# EAGLE design 1uT_u_v1_1 (EAGLE 9.2.2)
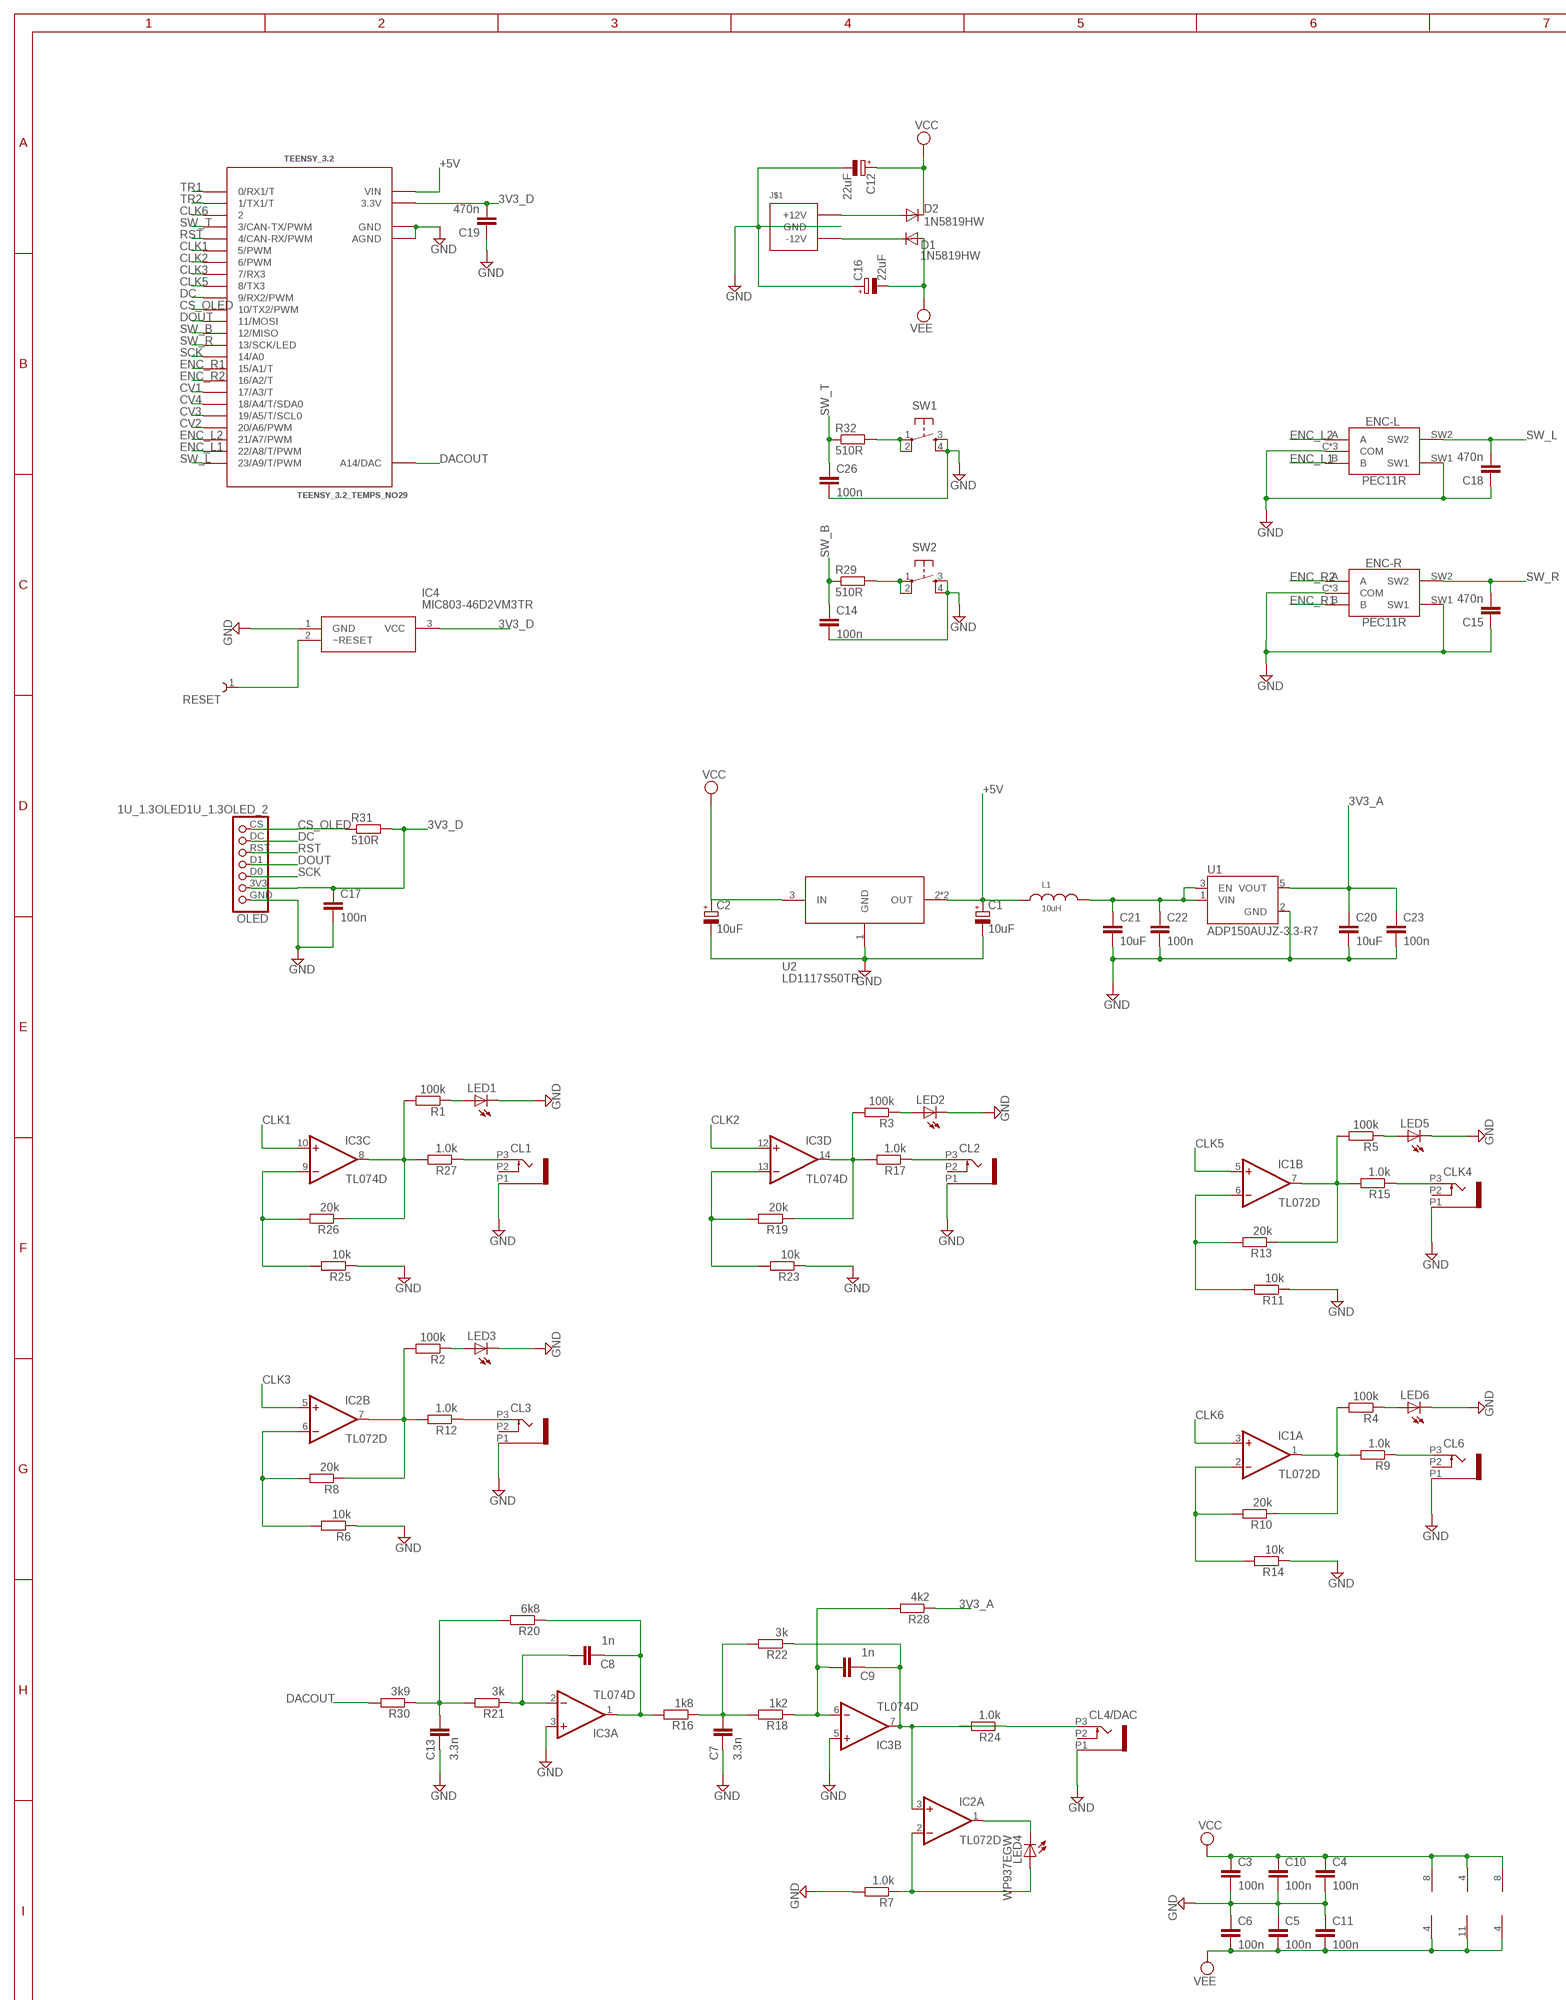
[diagram p0: schematic, sheet 1, part 1 of 2]
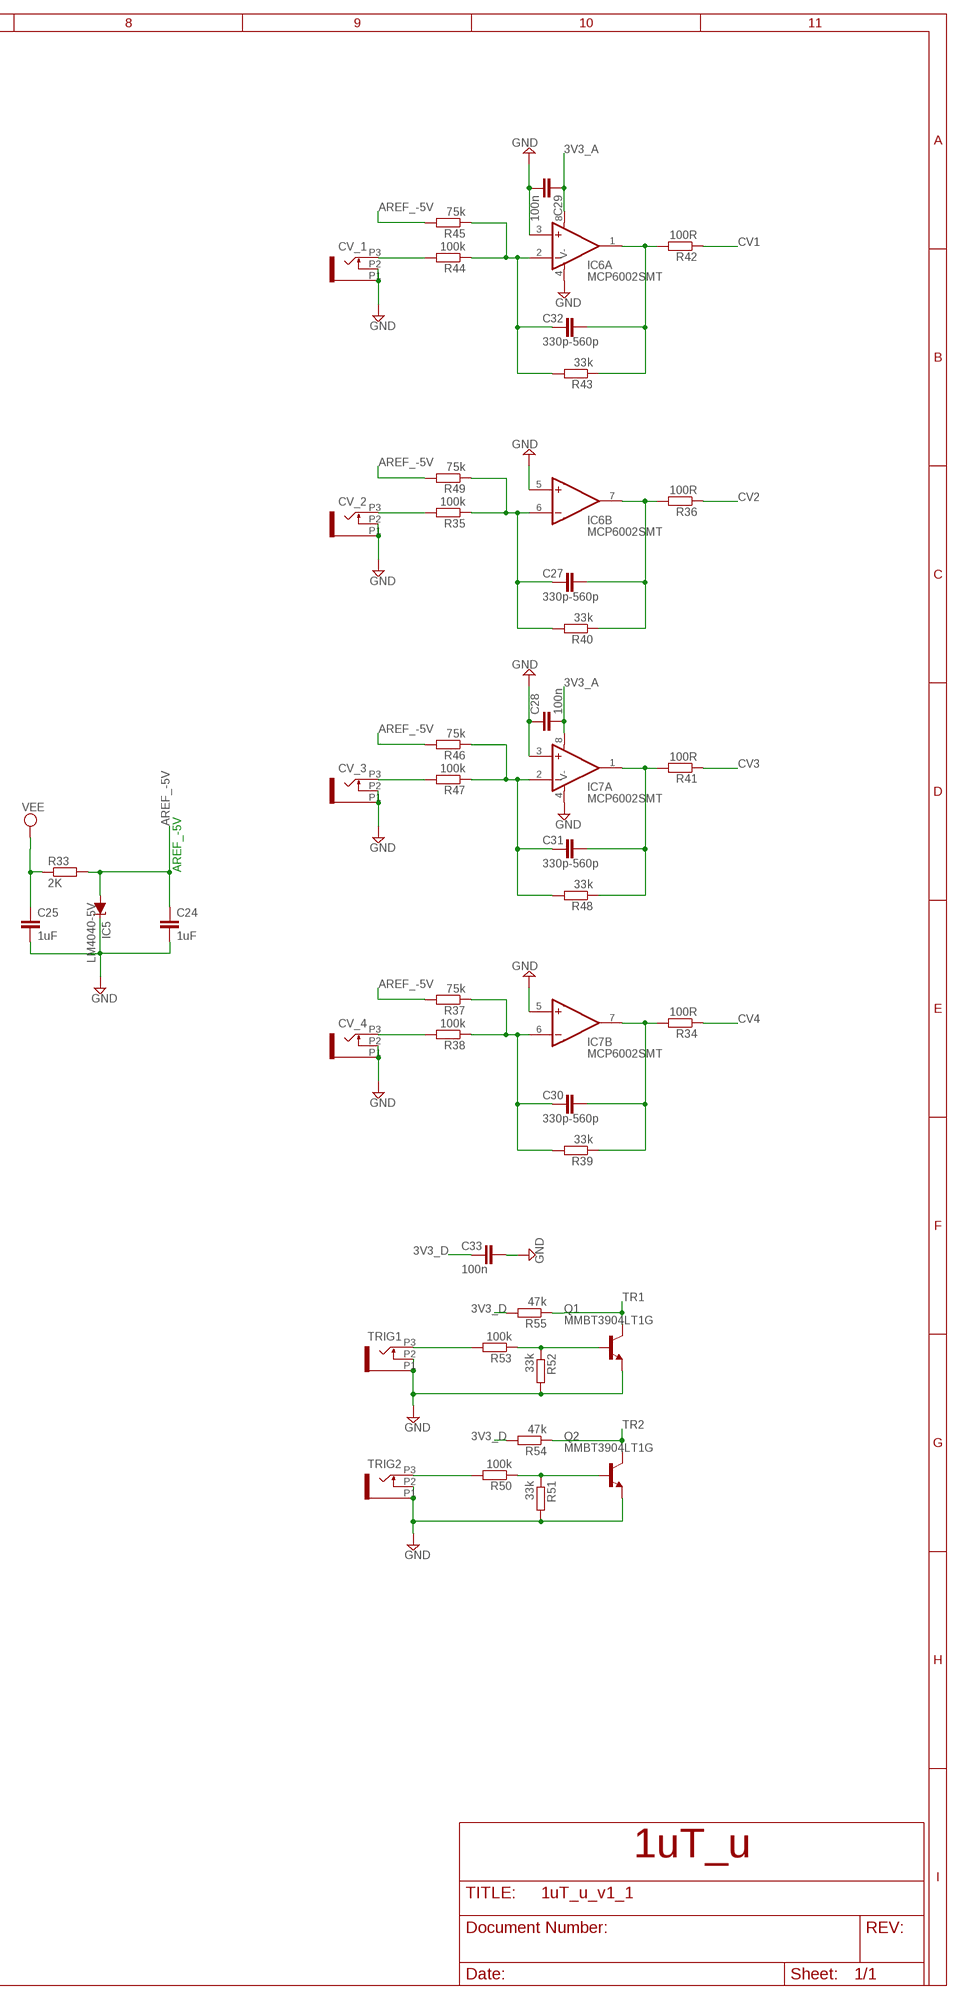
[diagram p1: schematic, sheet 1, part 2 of 2]

## Parts
C1  10uF  CPOL-EUB  [PANASONIC_B]
C2  10uF  CPOL-EUB  [PANASONIC_B]
C3  100n  C-EUC0603  [C0603]
C4  100n  C-EUC0603  [C0603]
C5  100n  C-EUC0603  [C0603]
C6  100n  C-EUC0603  [C0603]
C7  3.3n  C-EUC0603  [C0603]
C8  1n  C-EUC0603  [C0603]
C9  1n  C-EUC0603  [C0603]
C10  100n  C-EUC0603  [C0603]
C11  100n  C-EUC0603  [C0603]
C12  22uF  CPOL-EUC  [PANASONIC_C]
C13  3.3n  C-EUC0603  [C0603]
C14  100n  C-EUC0603  [C0603]
C15  470n  C-EUC0603  [C0603]
C16  22uF  CPOL-EUC  [PANASONIC_C]
C17  100n  C-EUC0603  [C0603]
C18  470n  C-EUC0603  [C0603]
C19  470n  C-EUC0603  [C0603]
C20  10uF  C-EUC1206K  [C1206K]
C21  10uF  C-EUC1206K  [C1206K]
C22  100n  C-EUC0603  [C0603]
C23  100n  C-EUC0603  [C0603]
C24  1uF  C-EUC0603  [C0603]
C25  1uF  C-EUC0603  [C0603]
C26  100n  C-EUC0603  [C0603]
C27  330p-560p  C-EUC0603  [C0603]
C28  100n  C-EUC0603  [C0603]
C29  100n  C-EUC0603  [C0603]
C30  330p-560p  C-EUC0603  [C0603]
C31  330p-560p  C-EUC0603  [C0603]
C32  330p-560p  C-EUC0603  [C0603]
C33  100n  C-EUC0603  [C0603]
CL1  OG-PJ301_PJ301_THONKICONN  [OG-PJ301_WQP_PJ_301M6_NO_HOLE]
CL2  OG-PJ301_PJ301_THONKICONN  [OG-PJ301_WQP_PJ_301M6_NO_HOLE]
CL3  OG-PJ301_PJ301_THONKICONN  [OG-PJ301_WQP_PJ_301M6_NO_HOLE]
CL4/DAC  OG-PJ301_PJ301_THONKICONN  [OG-PJ301_WQP_PJ_301M6_NO_HOLE]
CL6  OG-PJ301_PJ301_THONKICONN  [OG-PJ301_WQP_PJ_301M6_NO_HOLE]
CLK4  OG-PJ301_PJ301_THONKICONN  [OG-PJ301_WQP_PJ_301M6_NO_HOLE]
CV_1  OG-PJ301_PJ301_THONKICONN  [OG-PJ301_WQP_PJ_301M6_NO_HOLE]
CV_2  OG-PJ301_PJ301_THONKICONN  [OG-PJ301_WQP_PJ_301M6_NO_HOLE]
CV_3  OG-PJ301_PJ301_THONKICONN  [OG-PJ301_WQP_PJ_301M6_NO_HOLE]
CV_4  OG-PJ301_PJ301_THONKICONN  [OG-PJ301_WQP_PJ_301M6_NO_HOLE]
D1  1N5819HW  DIODE_DIODE-SOD123  [DIODE_SOD123]
D2  1N5819HW  DIODE_DIODE-SOD123  [DIODE_SOD123]
ENC-L  PEC11R  [PEC11R-4XXXK-SXXXX]
ENC-R  PEC11R  [PEC11R-4XXXK-SXXXX]
IC1  TL072D  [SO08]
IC2  TL072D  [SO08]
IC3  TL074D  [SO14]
IC4  MIC803-46D2VM3TR  [SOT95P230X110-3N]
IC5  LM4040-5V  LM4041B12DBZ  [DBZ_R-PDSO-G3]
IC6  MCP6002SMT  [SOIC8]
IC7  MCP6002SMT  [SOIC8]
J$1  POWER_SIMPLE10  [POWER_10]
L1  10uH  WE-LQ_1210_744032001  [WE-LQ_M]
LED1  LED3MM  [LED3MM]
LED2  LED3MM  [LED3MM]
LED3  LED3MM  [LED3MM]
LED4  WP937EGW  LED3MM  [LED3MM]
LED5  LED3MM  [LED3MM]
LED6  LED3MM  [LED3MM]
OLED  1U_1.3OLED1U_1.3OLED_2  [1U_1.3OLED_2]
Q1  MMBT3904LT1G  TRANSISTOR_MMBT3904LT1-NPN-SOT23-BEC  [TRANSISTOR_SOT23-BEC]
Q2  MMBT3904LT1G  TRANSISTOR_MMBT3904LT1-NPN-SOT23-BEC  [TRANSISTOR_SOT23-BEC]
R1  100k  R-EU_R0603  [R0603]
R2  100k  R-EU_R0603  [R0603]
R3  100k  R-EU_R0603  [R0603]
R4  100k  R-EU_R0603  [R0603]
R5  100k  R-EU_R0603  [R0603]
R6  10k  R-EU_R0603  [R0603]
R7  1.0k  R-EU_R0603  [R0603]
R8  20k  R-EU_R0603  [R0603]
R9  1.0k  R-EU_R0603  [R0603]
R10  20k  R-EU_R0603  [R0603]
R11  10k  R-EU_R0603  [R0603]
R12  1.0k  R-EU_R0603  [R0603]
R13  20k  R-EU_R0603  [R0603]
R14  10k  R-EU_R0603  [R0603]
R15  1.0k  R-EU_R0603  [R0603]
R16  1k8  R-EU_R0603  [R0603]
R17  1.0k  R-EU_R0603  [R0603]
R18  1k2  R-EU_R0603  [R0603]
R19  20k  R-EU_R0603  [R0603]
R20  6k8  R-EU_R0603  [R0603]
R21  3k  R-EU_R0603  [R0603]
R22  3k  R-EU_R0603  [R0603]
R23  10k  R-EU_R0603  [R0603]
R24  1.0k  R-EU_R0603  [R0603]
R25  10k  R-EU_R0603  [R0603]
R26  20k  R-EU_R0603  [R0603]
R27  1.0k  R-EU_R0603  [R0603]
R28  4k2  R-EU_R0603  [R0603]
R29  510R  R-EU_R0603  [R0603]
R30  3k9  R-EU_R0603  [R0603]
R31  510R  R-EU_R0603  [R0603]
R32  510R  R-EU_R0603  [R0603]
R33  2K  R-EU_R0603  [R0603]
R34  100R  R-EU_R0603  [R0603]
R35  100k  R-EU_R0603  [R0603]
R36  100R  R-EU_R0603  [R0603]
R37  75k  R-EU_R0603  [R0603]
R38  100k  R-EU_R0603  [R0603]
R39  33k  R-EU_R0603  [R0603]
R40  33k  R-EU_R0603  [R0603]
R41  100R  R-EU_R0603  [R0603]
R42  100R  R-EU_R0603  [R0603]
R43  33k  R-EU_R0603  [R0603]
R44  100k  R-EU_R0603  [R0603]
R45  75k  R-EU_R0603  [R0603]
R46  75k  R-EU_R0603  [R0603]
R47  100k  R-EU_R0603  [R0603]
R48  33k  R-EU_R0603  [R0603]
R49  75k  R-EU_R0603  [R0603]
R50  100k  R-EU_R0603  [R0603]
R51  33k  R-EU_R0603  [R0603]
R52  33k  R-EU_R0603  [R0603]
R53  100k  R-EU_R0603  [R0603]
R54  47k  R-EU_R0603  [R0603]
R55  47k  R-EU_R0603  [R0603]
RESET  61300111121  [61300111121]
SW1  TAC_SWITCHPTH  [TACTILE-PTH]
SW2  TAC_SWITCHPTH  [TACTILE-PTH]
TEENSY_3.2  TEENSY_3.2_TEMPS_NO29  [TEENSY_3.2_TEMPS_NO29]
TRIG1  OG-PJ301_PJ301_THONKICONN  [OG-PJ301_WQP_PJ_301M6_NO_HOLE]
TRIG2  OG-PJ301_PJ301_THONKICONN  [OG-PJ301_WQP_PJ_301M6_NO_HOLE]
U1  ADP150AUJZ-3.3-R7  [SOT95P280X100-5N]
U2  LD1117S50TR  [SOT223]

## Nets
3V3_A: C20.1 C23.1 C28.2 C29.1 IC6.8(A:V+) IC7.8(A:V+) R28.1 U1.5(VOUT)
3V3_D: C17.1 C19.2 C33.2 IC4.3(VCC) OLED.3V3 R31.2 R54.2 R55.2 TEENSY_3.2.3.3V
+5V: C1.+ L1.1 TEENSY_3.2.VIN U2.2(OUT) U2.4(OUT)
AREF_-5V: C24.1 IC5.2(A) R33.2 R37.2 R45.2 R46.2 R49.2
CLK1: IC3.10(C:+IN) TEENSY_3.2.5(5/PWM)
CLK2: IC3.12(D:+IN) TEENSY_3.2.6(6/PWM)
CLK3: IC2.5(B:+IN) TEENSY_3.2.7(7/RX3)
CLK5: IC1.5(B:+IN) TEENSY_3.2.8(8/TX3)
CLK6: IC1.3(A:+IN) TEENSY_3.2.2
CS_OLED: OLED.CS R31.1 TEENSY_3.2.10(10/TX2/PWM)
CV1: R42.1 TEENSY_3.2.17/A3(17/A3/T)
CV2: R36.1 TEENSY_3.2.20/A6(20/A6/PWM)
CV3: R41.1 TEENSY_3.2.19/A5(19/A5/T/SCL0)
CV4: R34.1 TEENSY_3.2.18/A4(18/A4/T/SDA0)
DACOUT: R30.2 TEENSY_3.2.RESET/DAC(A14/DAC)
DC: OLED.DC TEENSY_3.2.9(9/RX2/PWM)
DOUT: OLED.D1 TEENSY_3.2.11(11/MOSI)
ENC_L1: ENC-L.B TEENSY_3.2.22/A8(22/A8/T/PWM)
ENC_L2: ENC-L.A TEENSY_3.2.21/A7(21/A7/PWM)
ENC_R1: ENC-R.B TEENSY_3.2.15/A1(15/A1/T)
ENC_R2: ENC-R.A TEENSY_3.2.16/A2(16/A2/T)
GND: C1.- C2.- C3.2 C4.2 C5.1 C6.1 C7.2 C10.2 C11.1 C12.- C13.2 C14.2 C15.1 C16.+ C17.2 C18.1 C19.1 C20.2 C21.2 C22.2 C23.2 C24.2 C25.2 C26.2 C28.1 C29.2 C33.1 CL1.P1 CL2.P1 CL3.P1 CL4/DAC.P1 CL6.P1 CLK4.P1 CV_1.P1 CV_1.P2 CV_2.P1 CV_2.P2 CV_3.P1 CV_3.P2 CV_4.P1 CV_4.P2 ENC-L.C(COM) ENC-L.SH1(COM) ENC-L.SH2(COM) ENC-L.SW1 ENC-R.C(COM) ENC-R.SH1(COM) ENC-R.SH2(COM) ENC-R.SW1 IC3.3(A:+IN) IC3.5(B:+IN) IC4.1(GND) IC5.1(C) IC6.3(A:+IN) IC6.4(A:V-) IC6.5(B:+IN) IC7.3(A:+IN) IC7.4(A:V-) IC7.5(B:+IN) J$1.3(GND) J$1.4(GND) J$1.5(GND) J$1.6(GND) J$1.7(GND) J$1.8(GND) LED1.K(C) LED2.K(C) LED3.K(C) LED5.K(C) LED6.K(C) OLED.GND Q1.E Q2.E R6.1 R7.2 R11.1 R14.1 R23.1 R25.1 R51.2 R52.2 SW1.3 SW1.4 SW2.3 SW2.4 TEENSY_3.2.AGND TEENSY_3.2.GND TRIG1.P1 TRIG1.P2 TRIG2.P1 TRIG2.P2 U1.2(GND) U2.1(GND)
N$2: D2.A J$1.9(+12V) J$1.10(+12V)
N$3: C21.1 C22.1 L1.2 U1.1(VIN) U1.3(EN)
N$4: CV_1.P3 R44.2
N$5: C32.2 IC6.2(A:-IN) R43.2 R44.1 R45.1
N$6: C32.1 IC6.1(A:OUT) R42.2 R43.1
N$7: R32.2 SW1.1 SW1.2
N$8: CV_2.P3 R35.2
N$9: R29.2 SW2.1 SW2.2
N$10: C27.2 IC6.6(B:-IN) R35.1 R40.2 R49.1
N$11: C27.1 IC6.7(B:OUT) R36.2 R40.1
N$12: CV_3.P3 R47.2
N$13: C31.2 IC7.2(A:-IN) R46.1 R47.1 R48.2
N$14: C31.1 IC7.1(A:OUT) R41.2 R48.1
N$15: CV_4.P3 R38.2
N$16: C30.2 IC7.6(B:-IN) R37.1 R38.1 R39.2
N$17: C30.1 IC7.7(B:OUT) R34.2 R39.1
N$18: R53.2 TRIG1.P3
N$19: Q1.B R52.1 R53.1
N$20: R50.2 TRIG2.P3
N$21: Q2.B R50.1 R51.1
N$22: CL1.P3 R27.1
N$23: CL3.P3 R12.1
N$24: IC1.6(B:-IN) R11.2 R13.2
N$25: IC1.7(B:OUT) R5.2 R13.1 R15.2
N$26: IC3.13(D:-IN) R19.2 R23.2
N$27: IC3.9(C:-IN) R25.2 R26.2
N$28: IC3.8(C:OUT) R1.2 R26.1 R27.2
N$29: CLK4.P3 R15.1
N$30: IC3.14(D:OUT) R3.2 R17.2 R19.1
N$31: CL2.P3 R17.1
N$32: IC2.6(B:-IN) R6.2 R8.2
N$33: IC2.7(B:OUT) R2.2 R8.1 R12.2
N$34: IC1.2(A:-IN) R10.2 R14.2
N$35: IC2.1(A:OUT) LED4.K(C)
N$36: IC2.2(A:-IN) LED4.A R7.1
N$37: CL4/DAC.P3 R24.1
N$38: IC1.1(A:OUT) R4.2 R9.2 R10.1
N$39: CL6.P3 R9.1
N$40: C9.2 IC2.3(A:+IN) IC3.7(B:OUT) R22.1 R24.2
N$41: D1.C J$1.1(-12V) J$1.2(-12V)
N$42: C13.1 R20.2 R21.2 R30.1
N$43: C8.1 IC3.2(A:-IN) R21.1
N$44: C8.2 IC3.1(A:OUT) R16.2 R20.1
N$45: C7.1 R16.1 R18.2 R22.2
N$46: C9.1 IC3.6(B:-IN) R18.1 R28.2
N$47: LED3.A R2.1
N$48: LED1.A R1.1
N$49: LED2.A R3.1
N$50: LED5.A R5.1
N$51: LED6.A R4.1
N$52: IC4.2(~RESET) RESET.1
RST: OLED.RST TEENSY_3.2.4(4/CAN-RX/PWM)
SCK: OLED.D0 TEENSY_3.2.14/A0
SW_B: C14.1 R29.1 TEENSY_3.2.12(12/MISO)
SW_L: C18.2 ENC-L.SW2 TEENSY_3.2.23/A9(23/A9/T/PWM)
SW_R: C15.2 ENC-R.SW2 TEENSY_3.2.13(13/SCK/LED)
SW_T: C26.1 R32.1 TEENSY_3.2.3(3/CAN-TX/PWM)
TR1: Q1.C R55.1 TEENSY_3.2.0(0/RX1/T)
TR2: Q2.C R54.1 TEENSY_3.2.1(1/TX1/T)
VCC: C2.+ C3.1 C4.1 C10.1 C12.+ D2.C IC1.8(P:V+) IC2.8(P:V+) IC3.4(P:V+) U2.3(IN)
VEE: C5.2 C6.2 C11.2 C16.- C25.1 D1.A IC1.4(P:V-) IC2.4(P:V-) IC3.11(P:V-) R33.1
Unconnected: CL1.P2 CL2.P2 CL3.P2 CL4/DAC.P2 CL6.P2 CLK4.P2

## Notes on the sheet
- AREF_-5V
- 1uT_u

## Library data of the parts
C1 C2 C12 C16 = rcl:CPOL-EU: POLARIZED CAPACITOR, European symbol; SPICEPREFIX: C
C3-C11 C13-C15 C17-C33 = resistor:C-EU: CAPACITOR, European symbol
CL1-CL3 CL4/DAC CL6 CLK4 CV_1-CV_4 TRIG1 TRIG2 = SHAY_THONKICONNS:OG-PJ301_PJ301_THONKICONN
D1 D2 = elements_v02:DIODE_DIODE-: DIODE
ENC-L ENC-R = PEC11R-4215K-S0024:PEC11R: Incremental encoder 24 detents 24 pulses Bourns 24 Pulse Incremental Mechanical Rotary Encoder with a 6 mm Flat Shaft (Not Indexed), Through Hole Source: Datasheet <http://uk.rs-online.com/web/p/products/7377742>; ALLIED_NUMBER: 70407906; ALLIED_PRICE-STOCK: https://www.alliedelec.com/bourns-pec11r-4215k-s0024/70407906/; ARROW_PART_NUMBER: PEC11R-4215K-S0024; ARROW_PRICE-STOCK: http://uk.rs-online.com/web/p/products/1674651; DESCRIPTION: Incremental encoder 24 detents 24 pulses Bourns 24 Pulse Incremental Mechanical Rotary Encoder with a 6 mm Flat Shaft (Not Indexed), Through Hole; HEIGHT: mm; MANUFACTURER_NAME: Bourns; MANUFACTURER_PART_NUMBER: PEC11R-4215K-S0024; RS_PART_NUMBER: 1674651; RS_PRICE-STOCK: http://uk.rs-online.com/web/p/products/1674651
IC1 IC2 = linear:TL072: OP AMP
IC3 = linear:TL074: OP AMP
IC4 = MIC803-46D2VM3TR:MIC803-46D2VM3TR: 3-pin Microprocessor Supervosor Circui Source: Datasheet; ARROW_PART_NUMBER: MIC803-46D2VM3TR; DESCRIPTION: 3-pin Microprocessor Supervosor Circui; HEIGHT: mm; MANUFACTURER_NAME: Micrel; MANUFACTURER_PART_NUMBER: MIC803-46D2VM3TR
IC5 = texas:LM4041: PRECISION MICROPOWER SHUNT VOLTAGE REFERENCE Source: http://focus.ti.com/lit/ds/slcs146e/slcs146e.pdf; MPN: LM4041B12IDBZR; OC_FARNELL: 1575212; OC_NEWARK: 58K5882
IC6 IC7 = EurorackModularParts:MCP6002: Dual General Op Amp 1.8V min supply 1MHz (6V/us)
J$1 = EurorackModularParts:POWER_SIMPLE
L1 = Wurth_Elektronik_Passive_rev17b:WE-LQ_1210: SMD Inductor Characteristics Miniature chip inductor wound on a special ferrite core Small inductances for compact circuits High Q at high frequencies Low DC-resistance Operating temperature: –40 ºC to +125 ºC Applications Low power DC/DC-converters from Linear Technology, National Semiconductor, Texas Instruments, Fairchild Semiconductor, ON Semiconductor, STMicroelectronics, Maxim, MPS, Semtech, Exar, Analogic Tech, Diodes and Cologne Chip EMI-Filtering RF-circuits <http://katalog.we-online.de/media/images/eisos/IndLQ_pf2.jpg> Details see: http://katalog.we-online.de/en/pbs/WE-LQ? Updated by Dan Xu 2014-07-08 2014 (C) Wurth Elektronik; WE-NUMBER: 744032001/1uH
LED1-LED6 = led:LED: LED OSRAM: - CHIPLED LG R971, LG N971, LY N971, LG Q971, LY Q971, LO R971, LY R971 LH N974, LH R974 LS Q976, LO Q976, LY Q976 LO Q996 - Hyper CHIPLED LW Q18S LB Q993, LB Q99A, LB R99A - SideLED LS A670, LO A670, LY A670, LG A670, LP A670 LB A673, LV A673, LT A673, LW A673 LH A674 LY A675 LS A676, LA A676, LO A676, LY A676, LW A676 LS A679, LY A679, LG A679 - Hyper Micro SIDELED® LS Y876, LA Y876, LO Y876, LY Y876 LT Y87S - SmartLED LW L88C, LW L88S LB L89C, LB L89S, LG L890 LS L89K, LO L89K, LY L89K LS L896, LA L896, LO L896, LY L896 - TOPLED LS T670, LO T670, LY T670, LG T670, LP T670 LSG T670, LSP T670, LSY T670, LOP T670, LYG T670 LG T671, LOG T671, LSG T671 LB T673, LV T673, LT T673, LW T673 LH T674 LS T676, LA T676, LO T676, LY T676, LB T676, LH T676, LSB T676, LW T676 LB T67C, LV T67C, LT T67C, LS T67K, LO T67K, LY T67K, LW E67C LS E67B, LA E67B, LO E67B, LY E67B, LB E67C, LV E67C, LT E67C LW T67C LS T679, LY T679, LG T679 LS T770, LO T770, LY T770, LG T770, LP T770 LB T773, LV T773, LT T773, LW T773 LH T774 LS E675, LA E675, LY E675, LS T675 LS T776, LA T776, LO T776, LY T776, LB T776 LHGB T686 LT T68C, LB T68C - Hyper Mini TOPLED® LB M676 - Mini TOPLED Santana® LG M470 LS M47K, LO M47K, LY M47K Source: http://www.osram.convergy.de LUXEON: - LUMILED® LXK2-PW12-R00, LXK2-PW12-S00, LXK2-PW14-U00, LXK2-PW14-V00 LXK2-PM12-R00, LXK2-PM12-S00, LXK2-PM14-U00 LXK2-PE12-Q00, LXK2-PE12-R00, LXK2-PE12-S00, LXK2-PE14-T00, LXK2-PE14-U00 LXK2-PB12-K00, LXK2-PB12-L00, LXK2-PB12-M00, LXK2-PB14-N00, LXK2-PB14-P00, LXK2-PB14-Q00 LXK2-PR12-L00, LXK2-PR12-M00, LXK2-PR14-Q00, LXK2-PR14-R00 LXK2-PD12-Q00, LXK2-PD12-R00, LXK2-PD12-S00 LXK2-PH12-R00, LXK2-PH12-S00 LXK2-PL12-P00, LXK2-PL12-Q00, LXK2-PL12-R00 Source: www.luxeon.com KINGBRIGHT: KA-3528ASYC Source: www.kingbright.com
OLED = 1U_1.3oled:1U_1.3OLED
Q1 Q2 = braids_v50:TRANSISTOR_*-NPN-: NPN Transistror BF959 corrected 2008.03.06
R1-R55 = rcl:R-EU_: RESISTOR, European symbol; SPICEPREFIX: R
RESET = Wurth_Elektronik_Electromechanic_Board_to_Board_Connectors_rev17a:61300111121: WR-PHD 2.54 mm Pin Header, 1Pin=>Code : Con_BTB_PHD_2.54_1_THT_61300111121 <http://katalog.we-online.de/media/images/eican/Con_BTB_PHD_2.54_1_THT_6130xx11121_pf2.jpg> Details see: http://katalog.we-online.de/en/em/613_0xx_111_21 Created 2014-05-29, Karrer Zheng 2014 (C) Würth Elektronik
SW1 SW2 = SparkFun:TAC_SWITCH: Momentary Switch Button commonly used for reset or general input. Spark Fun Electronics SKU : COM-00097
TEENSY_3.2 = Teensy_3_and_LC_Series_Boards_v1.4:TEENSY_3.2_TEMPS_NO29
U1 = ADP150AUJZ-2.3-R7:ADP150AUJZ-3.3-R7: IC REG LINEAR 2V 150MA 5TSOT; AVAILABILITY: Good; DESCRIPTION: LDO Regulator Pos 2V 0.15A 5-Pin TSOT T/R; MF: Analog Devices; MP: ADP150AUJZ-2.0-R7; PACKAGE: TSOT-23 Analog Devices; PRICE: 0.65 USD
U2 = LD1117S50TR:LD1117S50TR: http://octopart.com/ld1117s50tr-stmicroelectronics-529395; AVAILABILITY: Good; DESCRIPTION: LD1117 Series 1300 mA 5 V Fixed Output Positive Voltage LDO Regulator - SOT-223; MF: STMicroelectronics; MP: LD1117S50TR; PACKAGE: SOT-223 STMicroelectronics; PRICE: 0.19 USD

## Board
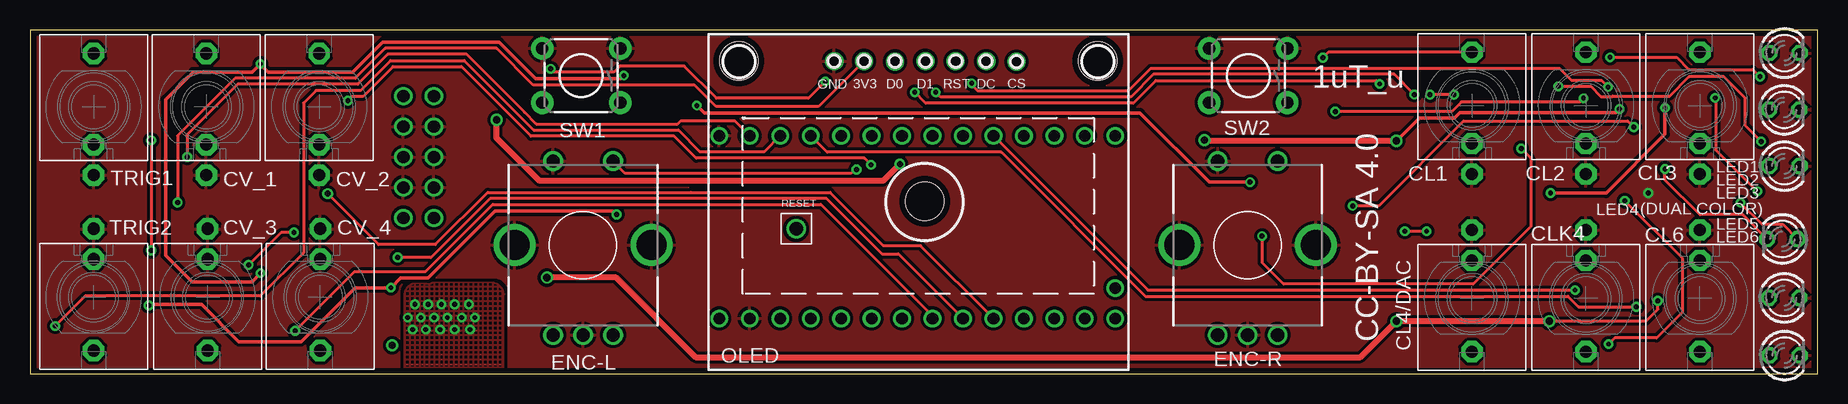
[diagram p2: board, top side]
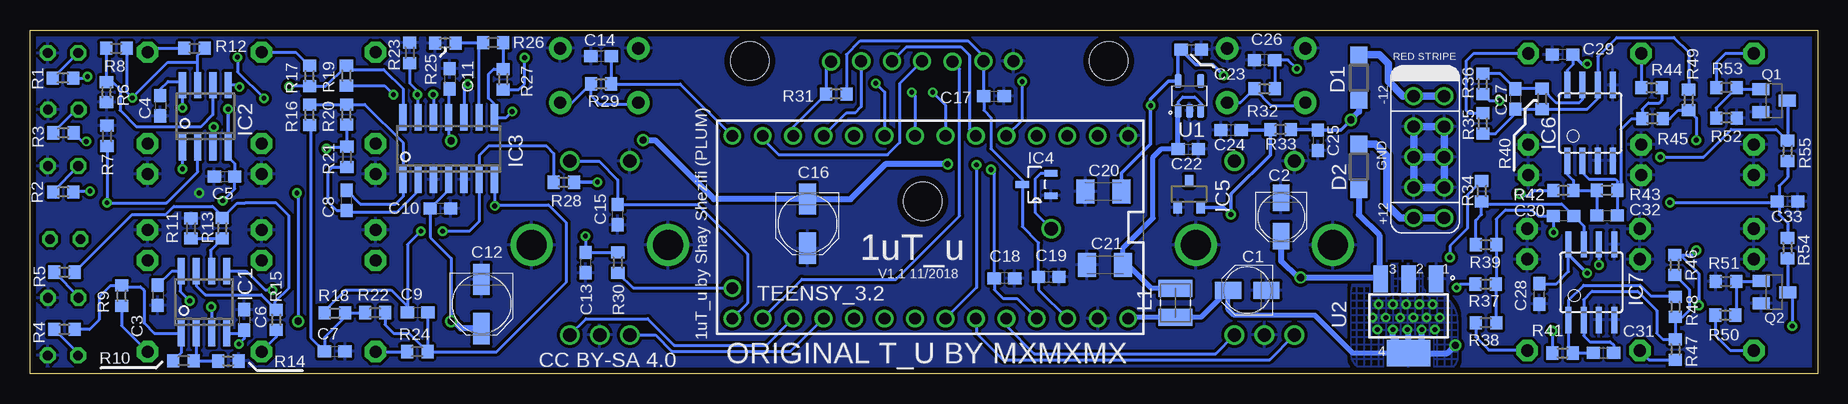
[diagram p3: board, bottom side, seen from below]

Size 149 x 28.7 mm. Coordinates in mm from the lower left corner, seen from the top.
Outline: 0,0 149,0 149,28.7 0,28.7 0,0
Copper layers (1*16): Top 0.035mm / dielectric 1.5mm / Bottom 0.035mm
Design rules "default *": minimum track width 6mil, minimum drill 0.4mm, track to track 10mil, track to pad 10mil, pad to pad 10mil, via to via 10mil, smd to smd 7mil, copper to edge 20mil, drill to drill 8mil, minimum pad ring 10mil, minimum via ring 8mil, stop-mask expansion 10mil, vias tented up to drill 25mil, thermal gap 10mil

### Footprints (pad centres in the part's own frame; a part is rotated, then mirrored left to right if it is on the bottom)
PANASONIC_B = smd 2.2 x 1.4: + 1.6,0; - -1.6,0
C0603 = smd 1.1 x 1: 1 -0.85,0; 2 0.85,0
PANASONIC_C = smd 2.6 x 1.4: + 2.05,0; - -2.05,0
C1206K = smd 1.5 x 2: 1 -1.5,0; 2 1.5,0
OG-PJ301_WQP_PJ_301M6_NO_HOLE = drill 1.016 pad 1.778 octagon: P1 0,-5.715; P2 0,-3.175; P3 0,4.445
DIODE_SOD123 = smd 1.4 x 1.4: A 1.9,0; C -1.9,0
PEC11R-4XXXK-SXXXX = drill 1.1 pad 1.65: A -2.5,-7.5; B 2.5,-7.5; C 0,-7.5; SW1 -2.5,7; SW2 2.5,7 | drill 2.5: SH1 -5.7,0; SH2 5.7,0
SO08 = smd 0.6 x 2.2: 1 -1.905,-2.6; 2 -0.635,-2.6; 3 0.635,-2.6; 4 1.905,-2.6; 5 1.905,2.6; 6 0.635,2.6; 7 -0.635,2.6; 8 -1.905,2.6
SO14 = smd 0.6 x 2.2: 1 -3.81,-2.6; 2 -2.54,-2.6; 3 -1.27,-2.6; 4 0,-2.6; 5 1.27,-2.6; 6 2.54,-2.6; 7 3.81,-2.6; 8 3.81,2.6; 9 2.54,2.6; 10 1.27,2.6; 11 0,2.6; 12 -1.27,2.6; 13 -2.54,2.6; 14 -3.81,2.6
SOT95P230X110-3N = smd 1.118 x 0.559: 1 -1.194,0.94; 2 -1.194,-0.94; 3 1.194,0
DBZ_R-PDSO-G3 = smd 0.7 x 1: 1 -0.95,-1.1; 2 0.95,-1.1; 3 0,1.1
SOIC8 = smd 0.5 x 2.2: 1 -1.905,-3.154; 2 -0.645,-3.154; 3 0.625,-3.154; 4 1.895,-3.154; 5 1.905,3.154; 6 0.635,3.154; 7 -0.635,3.154; 8 -1.905,3.154
POWER_10 = drill 1.016: 1 -5.08,-1.27; 2 -5.08,1.27; 3 -2.54,-1.27; 4 -2.54,1.27; 5 0,-1.27; 6 0,1.27; 7 2.54,-1.27; 8 2.54,1.27; 9 5.08,-1.27; 10 5.08,1.27
WE-LQ_M = smd 1.4 x 2.8: 1 -1.2,0; 2 1.2,0
LED3MM = drill 0.813 octagon: A -1.27,0; K 1.27,0
1U_1.3OLED_2 = drill 1: 3V3 -5.06,11.69; CS 7.66,11.64; D0 -2.48,11.65; D1 0.05,11.69; DC 5.13,11.68; GND -7.54,11.69; RST 2.58,11.67 | hole 3.2: 0,0; -15.494,11.684; 14.406,11.684
TRANSISTOR_SOT23-BEC = smd 1 x 1.4: B -0.95,-1.1; C 0,1.1; E 0.95,-1.1
R0603 = smd 1 x 1.1: 1 -0.85,0; 2 0.85,0
61300111121 = drill 1.1: 1 0,0
TACTILE-PTH = drill 1.016 pad 1.88: 1 -3.251,2.261; 2 3.251,2.261; 3 -3.251,-2.261; 4 3.251,-2.261
TEENSY_3.2_TEMPS_NO29 = drill 0.965: 0 -7.62,13.97; 1 -7.62,11.43; 2 -7.62,8.89; 3 -7.62,6.35; 3.3V 7.62,11.43; 4 -7.62,3.81; 5 -7.62,1.27; 6 -7.62,-1.27; 7 -7.62,-3.81; 8 -7.62,-6.35; 9 -7.62,-8.89; 10 -7.62,-11.43; 11 -7.62,-13.97; 12 -7.62,-16.51; 13 7.62,-16.51; 14/A0 7.62,-13.97; 15/A1 7.62,-11.43; 16/A2 7.62,-8.89; 17/A3 7.62,-6.35; 18/A4 7.62,-3.81; 19/A5 7.62,-1.27; 20/A6 7.62,1.27; 21/A7 7.62,3.81; 22/A8 7.62,6.35; 23/A9 7.62,8.89; AGND 7.62,13.97; GND -7.62,16.51; RESET/DAC 5.08,-16.51; VIN 7.62,16.51
SOT95P280X100-5N = smd 1.14 x 0.59: 1 -1.245,0.95; 2 -1.245,0; 3 -1.245,-0.95; 4 1.245,-0.95; 5 1.245,0.95
SOT223 = smd 2.235 x 1.219: 1 -3.099,2.311; 2 -3.099,0; 3 -3.099,-2.311 | smd 2.2 x 3.6: 4 3.099,0

### Placement (x,y rotation side)
C1  47.54,6.98 180 bottom
C2  44.71,13.1 270 bottom
C3  138.34,6.56 270 bottom
C4  138.14,22.38 270 bottom
C5  132.78,16.47 0 bottom
C6  131.13,4.51 270 bottom
C7  123.6,1.88 0 bottom
C8  122.6,14.48 90 bottom
C9  116.69,5.13 0 bottom
C10  114.79,13.81 0 bottom
C11  114.01,24.63 270 bottom
C12  111.37,5.84 270 bottom
C13  102.7,9.3 270 bottom
C14  101.4,26.5 180 bottom
C15  100,13.3 90 bottom
C16  84.2,12.54 270 bottom
C17  68.64,23.18 0 bottom
C18  67.77,7.99 180 bottom
C19  64.08,8.09 180 bottom
C20  59.54,15.24 180 bottom
C21  59.38,9.1 180 bottom
C22  52.45,18.75 0 bottom
C23  52.2,27.05 0 bottom
C24  48.89,20.34 180 bottom
C25  41.65,19.5 270 bottom
C26  46.1,26.2 180 bottom
C27  25.19,22.94 270 bottom
C28  23.18,6.68 90 bottom
C29  21.25,26.65 180 bottom
C30  21.17,13.19 180 bottom
C31  17.85,1.75 0 bottom
C32  17.54,13.21 0 bottom
C33  2.5,14.4 180 bottom
CL1  120.2,22.4 0 top
CL2  129.7,22.4 0 top
CL3  139.2,22.4 0 top
CL4/DAC  120.2,6.3 180 top
CL6  139.2,6.3 180 top
CLK4  129.7,6.3 180 top
CV_1  14.7,22.3 0 top
CV_2  24.1,22.3 0 top
CV_3  14.8,6.4 180 top
CV_4  24.2,6.4 180 top
D1  38.22,24.72 270 bottom
D2  38.23,17.28 90 bottom
ENC-L  46.1,10.75 0 top
ENC-R  101.5,10.75 0 top
IC1  134.5,5.99 0 bottom
IC2  134.39,21.5 0 bottom
IC3  114.1,18.8 0 bottom
IC4  65.09,15.81 180 bottom
IC5  52.38,15 0 bottom
IC6  18.95,20.95 0 bottom
IC7  18.85,7.65 0 bottom
J$1  32.39,18.1 270 bottom
L1  53.52,5.93 90 bottom
LED1  146.25,26.78 0 top
LED2  146.22,22.05 0 top
LED3  146.24,17.35 0 top
LED4  146.06,11.25 180 top
LED5  146.23,6.35 0 top
LED6  146.26,1.54 0 top
OLED  74.58,14.42 0 top
Q1  3.63,22.8 270 bottom
Q2  3.59,6.82 270 bottom
R1  146.26,24.69 0 bottom
R2  146.23,15.19 0 bottom
R3  146.22,20.12 0 bottom
R4  146.13,3.72 0 bottom
R5  146.12,8.5 0 bottom
R6  142.62,23.51 90 bottom
R7  142.58,19.85 90 bottom
R8  141.8,27.17 180 bottom
R9  141.36,6.52 90 bottom
R10  136.2,1.1 0 bottom
R11  135.58,12.14 270 bottom
R12  135.29,27.17 0 bottom
R13  132.97,12.15 270 bottom
R14  132.47,1.08 180 bottom
R15  128.47,4.51 90 bottom
R16  125.69,21.62 90 bottom
R17  125.69,24.85 270 bottom
R18  123.58,5.09 0 bottom
R19  122.62,24.89 270 bottom
R20  122.61,21.64 270 bottom
R21  122.59,18.1 90 bottom
R22  120.23,5.11 180 bottom
R23  117.35,26.8 270 bottom
R24  116.72,1.86 0 bottom
R25  114.39,27.6 0 bottom
R26  110.4,27.64 180 bottom
R27  109.55,24.59 90 bottom
R28  104.5,16 180 bottom
R29  101.4,24.2 180 bottom
R30  100,9.3 270 bottom
R31  81.8,23.35 0 bottom
R32  46.1,23.8 180 bottom
R33  44.76,20.4 180 bottom
R34  28,15.25 270 bottom
R35  27.9,20.9 90 bottom
R36  27.9,24.2 90 bottom
R37  27.65,7.5 180 bottom
R38  27.64,4.27 180 bottom
R39  27.64,10.78 0 bottom
R40  22.95,22.95 270 bottom
R41  21.25,1.75 0 bottom
R42  21.19,15.31 0 bottom
R43  17.55,15.33 0 bottom
R44  13.82,23.88 180 bottom
R45  13.76,21.3 0 bottom
R46  11.9,9.1 90 bottom
R47  11.85,2.05 270 bottom
R48  11.85,5.6 270 bottom
R49  10.75,22.85 270 bottom
R50  7.69,4.91 180 bottom
R51  7.62,7.71 180 bottom
R52  7.6,21.35 0 bottom
R53  7.59,23.89 180 bottom
R54  2.5,10.5 90 bottom
R55  2.5,18.6 270 bottom
RESET  63.87,12.11 0 top
SW1  45.95,24.9 180 top
SW2  101.55,24.9 180 top
TEENSY_3.2  73.96,12.25 270 bottom
TRIG1  5.3,22.3 0 top
TRIG2  5.3,6.4 180 top
U1  52.35,23.2 90 bottom
U2  34.09,4.84 270 bottom

### Tracks (layer width: path | path; a pad name or v marks a point on that pad's centre or on a via)
3V3_A  (via drill 0.4)
  Top 0.305: v19.2,8.4 18.5,7.7 13.5,7.7 11.3,9.9 11.3,22.9 13.6,25.2 18.54,25.2 v19.2,25.86 19.86,25.2 26.9,25.2 29.4,27.7 39.11,27.7 42.16,24.65 49.25,24.65 v49.5,24.9 | v101.7,16 98.3,16 92.52,21.77 56.22,21.77 v55.59,22.4
  Bottom 0.254: IC6.8 20.85,25.34 20.4,25.8 C29.1 | IC7.8 20.75,8.54 21.77,7.53 C28.2
  Bottom 0.305: v19.2,8.4 20.75,9.96 IC7.8 | C29.1 19.61,25.86 v19.2,25.86 | R28.1 v101.7,16 | v49.5,24.9 50.4,25.8 51.8,25.8 C23.1 53.3,26.8 U1.5 54.09,24.45 55.59,22.95 v55.59,22.4 55.59,20.3 55.59,19.2 58.04,16.75 C20.1
3V3_D  (via drill 0.4)
  Top 0.254: v12.3,14.3 12.3,19.88 17.08,24.67 27.12,24.67 29.62,27.17 38.89,27.17 41.94,24.12 55.39,24.12 57.2,22.31 65.72,22.31 OLED.3V3
  Bottom 0.254: R31.2 80.95,26.65 79.8,27.8 70.8,27.8 69.52,26.52 OLED.3V3 69.52,23.2 C17.1 69.49,21.99 68.9,21.4 68.9,18.8 66.28,16.18 IC4.3 66.28,12.3 64.93,10.95 C19.2 64.93,7.03 TEENSY_3.2.3.3V | R55.2 2.5,16.4 3.2,15.7 3.2,14.55 C33.2 | R54.2 2.5,12.6 3.2,13.3 3.2,14.25 C33.2 | C33.2 3.45,14.3 v12.3,14.3
+5V  (via drill 0.4, 0.6)
  Bottom 0.406: U2.4 38.73,1.74 41.89,4.9 48.64,4.9 49.14,5.4 C1.+ 51.39,4.73 L1.1 57.35,4.73 TEENSY_3.2.VIN
  Bottom 0.508: U2.4 30.85,1.74 v30.19,2.4 | U2.4 32.99,2.84 v32.99,3.7 | U2.4 35.39,3.04 v35.39,3.7 | U2.4 34.09,3.6 v34.19,3.7
  other vias: 32.09,5.8 33.19,5.8 34.29,5.8 35.39,5.8 36.59,5.8 37.09,4.7 35.99,4.7 34.79,4.7 33.69,4.7 32.59,4.7 31.49,4.7 31.89,3.7 36.69,3.7
  pour Bottom (hatched): 33.99,9.2 36.39,9.2 arc-90 38.89,6.7 38.89,1.7 arc-90 37.49,0.3 31.09,0.3 arc-90 29.99,1.4 29.99,4.4 arc-90 32.49,6.9 arc90 32.89,7.3 32.89,8.1 arc-90
  pour Top (hatched): 31.19,6.5 31.19,0 39.49,0 39.49,6.6 arc90 38.49,7.6 32.29,7.6 arc90
AREF_-5V  (via drill 0.4)
  Top 0.254: v10.1,19.5 v10.1,10.3
  Top 0.305: v9.9,5.72 9.98,5.8 14.3,5.8 17.4,2.7 22.6,2.7 27.1,7.2 v30.09,7.2 30.9,8.01 33.19,8.01 38.79,13.61 48.58,13.61 v48.89,13.3
  Bottom 0.254: R45.2 12.3,21.3 11.6,22 R49.2 10.1,21.35 v10.1,19.5 | R46.2 11.45,9.95 | 11.45,9.95 9.9,8.4 v9.9,5.72 | v10.1,10.3 10.45,9.95 11.45,9.95 | v30.09,7.2 29.79,7.5 R37.2
  Bottom 0.305: IC5.2 49.49,13.9 v48.89,13.3 48.89,15 45.61,18.28 R33.2 45.67,20.34 C24.1
CLK1  (via drill 0.4)
  Top 0.254: v73.75,23.5 74.66,22.59 91.96,22.59 93.85,24.48 112.22,24.48 v112.5,24.21
  Bottom 0.254: TEENSY_3.2.5 72.69,22.44 v73.75,23.5 | v112.5,24.21 112.83,23.88 IC3.10
CLK2  (via drill 0.4)
  Top 0.254: v115.4,23.32 113.72,24.99 93.64,24.99 91.75,23.1 75.9,23.1 v75.5,23.5
  Bottom 0.254: TEENSY_3.2.6 75.23,23.23 v75.5,23.5 | IC3.12 115.37,23.19 115.4,23.22 v115.4,23.32
CLK3  (via drill 0.4)
  Top 0.254: v78.5,24.25 78.5,24.11 79,23.61 91.54,23.61 93.43,25.5 127.49,25.5 128.48,24.51 130.98,24.51 v131.55,23.94
  Bottom 0.254: TEENSY_3.2.7 77.77,23.52 v78.5,24.25 | v131.55,23.94 131.71,24.1 IC2.5
CLK5  (via drill 0.4)
  Top 0.254: TEENSY_3.2.8 93.18,7 v128.79,7
  Bottom 0.254: v128.79,7 129.39,7 130.98,8.59 IC1.5
CLK6  (via drill 0.4)
  Top 0.254: TEENSY_3.2.2 66.44,18.5 80.96,18.5 92.98,6.49 128.2,6.49 129.08,5.6 v133.89,5.6
  Bottom 0.254: v133.89,5.6 133.87,5.58 IC1.3
CS_OLED
  Bottom 0.254: OLED.CS 82.65,25.65 R31.1 85.39,20.61 TEENSY_3.2.10
CV1  (via drill 0.5)
  Top 0.254: TEENSY_3.2.17/A3 74.24,10.7 71.15,10.7 66.69,15.16 55.09,15.16 38.15,15.16 33.79,10.79 29.05,10.79 v24.81,15.03
  Bottom 0.254: R42.1 23.59,15.31 24,14.9 24.67,14.9 v24.81,15.03
CV2  (via drill 0.4)
  Top 0.254: v26.5,22.8 26.84,23.14 27.75,23.14 30.25,25.64 35.97,25.64 41.77,19.84 53.69,19.84 55.54,17.99 69.56,17.99 v70.1,17.45
  Bottom 0.254: R36.1 27.35,22.8 v26.5,22.8 | v70.1,17.45 70.1,7.22 TEENSY_3.2.20/A6
CV3  (via drill 0.4)
  Top 0.254: v22.1,3.6 27.04,8.54 32.97,8.54 38.57,14.14 65.92,14.14 75.23,4.83 TEENSY_3.2.19/A5
  Bottom 0.254: v22.1,3.6 R41.1
CV4  (via drill 0.4)
  Top 0.254: TEENSY_3.2.18/A4 72.38,10.03 71.02,10.03 66.39,14.65 38.36,14.65 33.43,9.72 v30.64,9.72
  Bottom 0.254: R34.1 29.19,14.91 29.19,12.12 30.64,10.66 v30.64,9.72
DACOUT
  Bottom 0.254: TEENSY_3.2.RESET/DAC 98.72,7.17 R30.2
DC
  Bottom 0.254: TEENSY_3.2.9 80.92,21.8 80.2,21.8 79.71,22.29 OLED.DC
DOUT
  Bottom 0.254: TEENSY_3.2.11 87.93,19.63 86.6,18.3 77.5,18.3 76.5,19.3 76.5,24.24 OLED.D1
ENC_L1
  Bottom 0.254: ENC-L.B 50.15,1.7 65.3,1.7 67.61,4.01 TEENSY_3.2.22/A8
ENC_L2
  Bottom 0.254: ENC-L.A 45.66,1.19 67.89,1.19 70.1,3.4 70.1,4.58 TEENSY_3.2.21/A7
ENC_R1
  Bottom 0.254: ENC-R.B 102.65,4.6 97.5,4.6 95.3,2.4 87.62,2.4 TEENSY_3.2.15/A1
ENC_R2
  Bottom 0.254: ENC-R.A 96.87,3.25 95.51,1.89 85.59,1.89 TEENSY_3.2.16/A2
GND  (via drill 0.4)
  Bottom 0.61: J$1.5 J$1.6 | J$1.6 J$1.4 J$1.3 J$1.5 | J$1.5 J$1.7 J$1.8 J$1.6
  other vias: 134.89,15.1
  pour Top (rank 3): 0,29 149,29 149,0 0,0
  pour Bottom (rank 3): 0,29 149,29 149,0 0,0
N$2
  Bottom 0.61: J$1.10 J$1.9 34.76,13.02 35.89,14.15 35.89,18.2 36.87,19.18 D2.A
N$3
  Bottom 0.254: U1.1 53.3,22.7 52.9,23.1 51.9,23.1 51.4,22.6 U1.3
  Bottom 0.406: U1.1 C22.1 54.74,18.75 55.39,18.1 55.39,13 57.88,10.51 C21.1 57.49,9.1 55.52,7.13 L1.2
N$4
  Bottom 0.254: R44.2 14.67,26.71 CV_1.P3
N$5
  Bottom 0.254: C32.2 R43.2 | IC6.2 19.59,16.8 19.06,16.26 16.86,16.26 16.7,16.1 R43.2 | R43.2 16.4,15.63 16.4,20.4 15.5,21.3 R45.1 14.61,22.09 14.1,22.6 13.2,22.6 12.97,22.83 R44.1
N$6
  Bottom 0.254: IC6.1 20.85,16.66 20.34,16.14 R42.2 18.42,15.31 R43.1 C32.1
N$7
  Bottom 0.254: SW1.1 48.11,22.64 R32.2 45.55,22.4 42.94,22.4 SW1.2
N$8
  Bottom 0.254: R35.2 29.05,21.75 29.3,22 29.3,26.1 28.65,26.75 CV_2.P3
N$9
  Bottom 0.254: SW2.1 103.81,22.64 R29.2 102.25,23.25 101.5,22.5 98.44,22.5 SW2.2
N$10
  Bottom 0.254: R49.1 10.75,26.85 11.96,28.07 16.73,28.07 18.31,26.48 IC6.6 18.31,22.98 19.2,22.1 22.8,22.1 | R40.2 22.8,22.1 | 22.8,22.1 22.81,22.09 C27.2 25.19,21.71 26.85,20.05 R35.1
N$11
  Bottom 0.254: R36.2 26.45,25.05 C27.1 R40.1 21.76,22.61 19.88,22.61 19.58,22.9 IC6.7
N$12
  Bottom 0.254: CV_3.P3 14.04,1.2 R47.2
N$13
  Bottom 0.254: C31.2 17,2.4 17.3,2.7 19,2.7 19.49,3.19 IC7.2 19.49,6.2 19.5,6.2 18.8,6.9 15,6.9 13.4,5.3 13.4,3.4 12.9,2.9 R47.1 R48.2 11.25,4.75 10.7,5.3 10.7,7.05 R46.1
N$14
  Bottom 0.254: C31.1 R41.2 20.75,2.1 IC7.1 20.75,6.14 19.49,7.41 14.79,7.41 13.88,6.5 11.9,6.5 R48.1
N$15
  Bottom 0.254: R38.2 28.49,3.09 27.4,2 24.24,2 CV_4.P3
N$16  (via drill 0.4)
  Top 0.254: v18.22,9.1 20.92,11.8 v22,11.8
  Bottom 0.254: v22,11.8 22.02,11.82 C30.2 23.29,13.19 23.79,13.69 26.01,13.69 26.79,12.91 R39.2 R37.1 R38.1 | v18.22,9.1 IC7.6
N$17
  Bottom 0.254: IC7.7 19.48,12.36 C30.1 21.33,14.2 27.8,14.2 | R34.2 28,13.3 28.49,12.81 R39.1
  Bottom 0.305: R34.2 27.8,14.2
N$18
  Bottom 0.254: R53.2 8.44,25.96 7.66,26.75 TRIG1.P3
N$19
  Bottom 0.254: Q1.B 6.6,23.75 R53.1 8.45,22.18 R52.1
N$20
  Bottom 0.254: TRIG2.P3 7.25,1.96 8.54,3.24 R50.2
N$21
  Bottom 0.254: Q2.B 4.75,7.71 R51.1 6.77,4.98 R50.1
N$22  (via drill 0.4)
  Top 0.254: v107.77,26.38 108.23,26.84 CL1.P3
  Bottom 0.254: R27.1 108.25,23.74 107.79,24.2 107.79,26.36 v107.77,26.38
N$23
  Bottom 0.254: R12.1 138.88,27.17 CL3.P3
N$24
  Bottom 0.254: R11.2 R13.2 133.95,10.32 133.95,8.67 IC1.6
N$25
  Bottom 0.254: R13.1 132.89,13.09 | 132.89,13.09 131.72,14.25 131.08,14.25 131.07,14.24 128.46,14.24 127.45,13.24 127.45,7.14 128.59,6 128.59,5.36 R15.2 129.71,6.6 134.39,6.6 135.14,7.34 IC1.7 | R5.2 140.49,13.29 137.71,13.29 137.01,13.98 133.78,13.98 132.89,13.09
N$26  (via drill 0.4)
  Top 0.254: v118.7,23.3 v116.7,23.3
  Bottom 0.254: IC3.13 116.7,21.46 v116.7,23.3 116.7,23.61 117.35,24.26 R23.2 | v118.7,23.3 119.44,24.04 R19.2
N$27
  Bottom 0.254: R25.2 113.5,27.64 R26.2 111.56,27.33 IC3.9
N$28  (via drill 0.4)
  Top 0.254: v108.8,21.9 118.5,21.9 119.3,22.7 129.2,22.7 v129.5,23 | v144.2,24.8 143.6,25.4 138.29,25.4 137.27,26.42 v131.7,26.42
  Bottom 0.254: v129.5,23 131.7,25.2 v131.7,26.42 | v144.2,24.8 144.31,24.69 R1.2 | R26.1 R27.2 110.35,25.44 110.79,25 110.79,23 110.29,22.5 IC3.8 109.3,21.4 v108.8,21.9
N$29
  Bottom 0.254: R15.1 128.47,3.08 CLK4.P3
N$30  (via drill 0.4)
  Top 0.254: v127.39,24 130.09,24 130.93,23.16 131.87,23.16 131.92,23.2 136.69,23.2 138.29,24.8 141.19,24.8 142.99,23 142.99,20.71 v144.3,19.4
  Bottom 0.254: IC3.14 117.91,23.81 119.5,25.4 122.28,25.4 R19.1 124.36,24 R17.2 v127.39,24 | R3.2 144.65,19.4 v144.3,19.4
N$31
  Bottom 0.254: R17.1 126.83,26.84 CL2.P3
N$32
  Bottom 0.254: R8.2 142.65,24.39 R6.2 142.11,24.36 141.5,23.75 141.5,22 140.1,20.6 138.8,20.6 134.79,20.6 133.75,21.64 IC2.6
N$33  (via drill 0.4)
  Top 0.254: v140.47,23.04 140.5,23.01 140.5,18.7 143.95,15.25 v144,15.25
  Bottom 0.254: R2.2 145.32,15.25 v144,15.25 | IC2.7 135.03,26 | 135.03,26 135.03,26.59 R12.2 | R8.1 140.95,23.52 v140.47,23.04 137.51,26 135.03,26
N$34
  Bottom 0.254: R10.2 135.29,1.1 | 135.29,1.1 133.34,1.1 R14.2 | IC1.2 135.14,1.25 135.29,1.1
N$35  (via drill 0.4)
  Top 0.254: LED4.K 142.75,13.29 139.19,13.29 136.29,16.18 v136.29,17.1
  Bottom 0.254: v136.29,17.1 IC2.1
N$36  (via drill 0.4)
  Top 0.254: LED4.A 146.09,12.49 144.36,12.49 v142.58,14.28
  Bottom 0.254: R7.1 142.58,14.4 v142.58,14.28 137.61,14.28 134.99,16.9 135.03,16.93 IC2.2
N$37
  Bottom 0.254: R24.1 CL4/DAC.P3
N$38
  Bottom 0.254: R4.2 144.03,3.72 143.23,4.52 143.23,6.43 142.29,7.37 R9.2 141.26,7.27 139.8,7.27 139.5,6.97 139.5,4.25 138.64,3.39 IC1.1 136.41,1.75 R10.1
N$39
  Bottom 0.254: CL6.P3 141.36,4.01 R9.1
N$40  (via drill 0.4)
  Top 0.254: v110.26,14.02 112.42,14.02 119.49,21.1 133.19,21.1 v133.69,20.59
  Bottom 0.254: R24.2 115.84,1.89 C9.2 | R24.2 117.41,3.4 118.7,3.4 119.4,4.1 119.4,5.09 R22.1 | R24.2 110.09,1.86 104.29,7.66 104.29,12.6 105.79,14.1 110.18,14.1 v110.26,14.02 110.29,14.05 IC3.7 | v133.69,20.59 133.79,20.49 133.79,18.93 IC2.3
N$41
  Bottom 0.61: J$1.2 J$1.1 34.56,23.18 35.79,24.41 35.79,25.9 36.51,26.62 D1.C
N$42  (via drill 0.4)
  Top 0.254: v102.7,11.5 102.7,9.3 104.49,7.51 120.31,7.51 125.1,12.3 125.1,18 v124.3,18.8
  Bottom 0.254: R30.1 C13.1 v102.7,11.5 | v124.3,18.8 124.15,18.95 R21.2 122.59,20.77 R20.2
N$43
  Bottom 0.254: IC3.2 116.64,15.26 118.4,13.5 122.47,13.5 C8.1 123.43,13.63 124.2,14.4 124.2,16.8 123.75,17.25 R21.1
N$44
  Bottom 0.254: R16.2 122.63,22.47 R20.1 121.09,22.49 117.91,19.31 IC3.1 117.91,14.79 118.5,14.2 121.47,14.2 C8.2
N$45
  Bottom 0.254: R22.2 122.71,5.11 R18.2 122.73,4.77 124.45,3.05 C7.1 125.6,3.03 125.6,20.68 R16.1
N$46  (via drill 0.4)
  Top 0.254: v116.42,11.9 v114.6,11.9
  Bottom 0.254: R28.2 105.35,18.4 105.95,19 110.79,19 111.56,18.23 IC3.6 111.56,12.73 112.39,11.9 v114.6,11.9 | v116.42,11.9 117.54,10.78 C9.1 117.54,5.64 118.9,7 122.7,7 124.43,5.27 R18.1
N$47
  Bottom 0.254: LED3.A 147.08,15.24 R2.1
N$48
  Bottom 0.254: R1.1 145.02,26.78 LED1.A
N$49
  Bottom 0.254: R3.1 145.14,22.05 LED2.A
N$50
  Bottom 0.254: R5.1 144.96,6.49 LED5.A
N$51
  Bottom 0.254: R4.1 144.99,1.73 LED6.A
N$52
  Bottom 0.254: RESET.1 65.19,13.43 65.19,16.3 64.74,16.75 IC4.2
RST
  Bottom 0.254: OLED.RST 75.96,27.29 71.4,27.29 70.7,26.59 70.7,20.42 TEENSY_3.2.4
SCK
  Bottom 0.254: OLED.D0 71.5,25.47 71.5,13.2 76.8,7.9 84.66,7.9 TEENSY_3.2.14/A0
SW_B
  Bottom 0.254: C14.1 R29.1 94.8,24.2 TEENSY_3.2.12
SW_L  (via drill 0.4)
  Top 0.254: v68.9,17.05 68.75,17.05 68.43,16.73 49.62,16.73 ENC-L.SW2
  Bottom 0.254: TEENSY_3.2.23/A9 66.74,6.3 67.89,6.3 68.62,7.03 C18.2 | C18.2 68.43,7.99 | C18.2 68.62,16.77 v68.9,17.05
SW_R
  Bottom 0.254: TEENSY_3.2.13 89.2,5.9 89.2,10 93.35,14.15 C15.2 100,16.2 101.55,17.75 ENC-R.SW2
SW_T  (via drill 0.4)
  Top 0.254: v66.29,24.4 64.89,23 57.22,23 54.54,25.68 49.18,25.68 48.67,25.18 43.39,25.18 v43.39,25.46
  Bottom 0.254: R32.1 C26.1 44.13,26.2 v43.39,25.46 | TEENSY_3.2.3 66.29,21.19 v66.29,24.4
TR1  (via drill 0.4)
  Top 0.254: v13.1,18.1 13.1,19.96 17.29,24.16 27.33,24.16 29.83,26.66 36.4,26.66 41.21,21.84 41.21,21.83 42.19,20.86 53.99,20.86 54.23,21.1 58.76,21.1 TEENSY_3.2.0
  Bottom 0.254: Q1.C 2.5,22.77 R55.1 3.45,20.4 7.2,20.4 9.5,18.1 v13.1,18.1
TR2  (via drill 0.4)
  Top 0.254: v2.1,4 4.6,6.5 14.48,6.5 14.49,6.49 19.19,6.49 22.8,10.1 22.8,22.6 23.85,23.65 27.54,23.65 30.04,26.15 36.19,26.15 40.71,21.64 40.71,21.62 41.98,20.35 54.04,20.35 55.82,18.57 61.23,18.57 TEENSY_3.2.1
  Bottom 0.254: R54.1 Q2.C 2.1,6.43 v2.1,4
VCC  (via drill 0.4, 0.6)
  Top 0.254: v135.69,6.1 135.69,5.4 134.69,4.4 v126.65,4.4
  Top 0.305: v136.29,22.2 136.29,20 131.38,15.09 v126.75,15.09
  Top 0.508: v126.65,4.4 v113.89,4.4 110.89,1.4 55.49,1.4 48.85,8.04 v43.09,8.04
  Bottom 0.254: IC3.4 114.1,15.35 C10.1 115.64,11.39 113.89,9.64 v113.89,4.4 | v135.69,6.1 136.49,6.9 136.49,8.51 IC1.8 137.16,8.59 C3.1 | v136.29,22.2 IC2.8 136.59,24.4 137.49,24.4 138.14,23.75 C4.1 | v126.65,4.4 126.65,14.99 v126.75,15.09
  Bottom 0.508: v113.89,4.4 113.69,4.4 113.08,3.79 C12.+ | D2.C 38.23,13.28 36.54,11.59 36.54,7.8 U2.3 36.5,8.04 v43.09,8.04 43.33,8.04 44.71,9.42 C2.+
VEE  (via drill 0.4, 0.5, 0.6)
  Top 0.254: v131.59,2.5 132.09,3 135.59,3 137.75,5.16 137.75,9.63 v132.94,14.45
  Top 0.305: v113.9,19.45 115.82,21.37 118.72,21.37 119.17,21.82 132.21,21.82 v132.49,22.1
  Top 0.508: v113.9,19.45 97.95,19.45 v97.9,19.5 | v72.5,17.5 71.1,16.1 42.49,16.1 38.89,19.7 v38.89,21.2
  Bottom 0.254: C11.2 114.1,23.69 IC3.11 114.1,19.65 v113.9,19.45 | IC1.4 131.4,3.39 C6.2 131.13,2.96 v131.59,2.5 | IC2.4 132.49,18.09 131.93,17.54 C5.2 131.93,15.45 v132.94,14.45
  Bottom 0.305: IC2.4 v132.49,22.09 v132.49,22.1 | v38.89,21.2 39.74,20.35 C25.1 41.7,20.4 R33.1
  Bottom 0.508: v72.5,17.5 77.69,17.5 80.6,14.59 C16.- 91.99,14.59 96.9,19.5 v97.9,19.5 | D1.A 38.22,21.87 v38.89,21.2

### Text on the board
tPlace: 1uT_u | (DUAL COLOR) | CC-BY-SA 4.0
bPlace: 1uT_u by Shay Shezifi (PLUM) | 1uT_u | V1.1 11/2018 | ORIGINAL T_U BY MXMXMX | CC BY-SA 4.0